# EAGLE schematic bttbox (EAGLE 6.2)
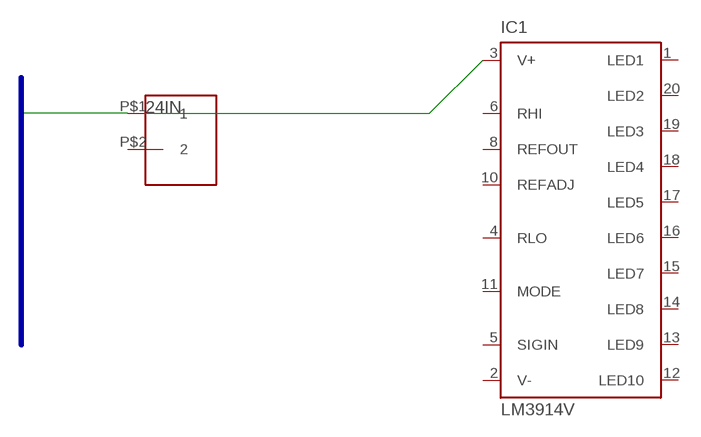
[diagram p0: schematic, sheet 1]

## Parts
IC1  LM3914V  [PLCC20S]
U$1  SCREWTERM  [MOLEX2PINSCREWTERM]

## Nets
24IN: U$1.P$1
N$2: IC1.3(V+)
Unconnected: IC1.1(LED1) IC1.4(RLO) IC1.5(SIGIN) IC1.6(RHI) IC1.8(REFOUT) IC1.10(REFADJ) IC1.11(MODE) IC1.12(LED10) IC1.13(LED9) IC1.14(LED8) IC1.15(LED7) IC1.16(LED6) IC1.17(LED5) IC1.18(LED4) IC1.19(LED3) IC1.20(LED2) U$1.P$2

## Buses
24IN

## Power pins joined to a net without a drawn wire
V-: IC1.2(V-)

## Library data of the parts
IC1 = national-semiconductor:LM391: Dot/Bar Display Driver Source: Data sheet LM3915 <http://www.national.com/ds/LM/LM3915.pdf> Data sheet LM3914 <http://www.national.com/ds/LM/LM3914.pdf>
U$1 = customparts:SCREWTERM